# Altium schematic sheet Reefing-Radio.SchDoc: Reefing System
size A4; DocumentNumber: Subtitle; Revision: V1.0; SheetNumber: 8; SheetTotal: 13; Author: Luca Jost; Subtitle: Radio
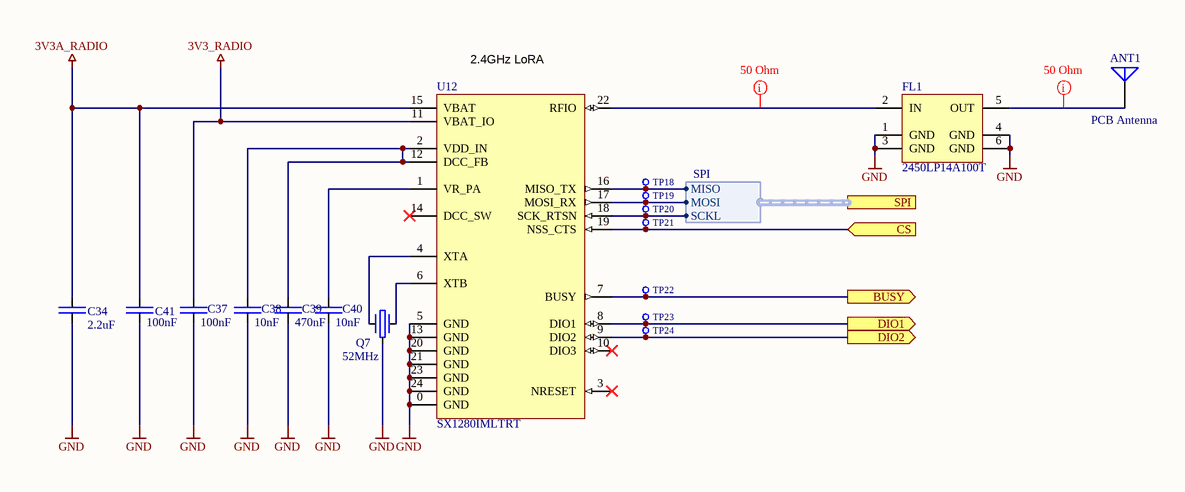
[diagram p0: Reefing-Radio.SchDoc]

## Parts
ANT1  PCB Antenna  [SMD Antenna 2.4GHz TI-AN043]
C34  2.2uF  [SMD Keramikkondensator 0402]
C37  100nF  [SMD Keramikkondensator 0402]
C38  10nF  [SMD Keramikkondensator 0402]
C39  470nF  [SMD Keramikkondensator 0402]
C40  10nF  [SMD Keramikkondensator 0402]
C41  100nF  [SMD Keramikkondensator 0402]
FL1  2450LP14A100T  [SMD Filter 2450LP14A100T]
Q7  52MHz  [SMD Crystal 2520]
TP18  X-TP  [SMD Testpoint 1mm]  (value not drawn)  (no BOM)
TP19  X-TP  [SMD Testpoint 1mm]  (value not drawn)  (no BOM)
TP20  X-TP  [SMD Testpoint 1mm]  (value not drawn)  (no BOM)
TP21  X-TP  [SMD Testpoint 1mm]  (value not drawn)  (no BOM)
TP22  X-TP  [SMD Testpoint 1mm]  (value not drawn)  (no BOM)
TP23  X-TP  [SMD Testpoint 1mm]  (value not drawn)  (no BOM)
TP24  X-TP  [SMD Testpoint 1mm]  (value not drawn)  (no BOM)
U12  SX1280IMLTRT  [SMD IC QFN-24]

## Ports
BUSY (out), CS (in), DIO1 (out), DIO2 (out), SPI (harness SPI)

## Harnesses
SPI: SCKL, MOSI, MISO

## Nets
3V3_RADIO: C37.2 U12.11(VBAT_IO)
3V3A_RADIO: C34.2 C41.2 U12.15(VBAT)
GND: C34.1 C37.1 C38.1 C39.1 C40.1 C41.1 FL1.1(GND) FL1.3(GND) FL1.4(GND) FL1.6(GND) Q7.3 U12.0(GND) U12.5(GND) U12.13(GND) U12.20(GND) U12.21(GND) U12.23(GND) U12.24(GND)
BUSY: TP22.1 U12.7(BUSY) ; port BUSY
CS: TP21.1 U12.19(NSS_CTS) ; port CS
DIO1: TP23.1 U12.8(DIO1) ; port DIO1
DIO2: TP24.1 U12.9(DIO2) ; port DIO2
NetANT1_1: ANT1.1 FL1.5(OUT)
NetC38_2: C38.2 C39.2 U12.2(VDD_IN) U12.12(DCC_FB)
NetC40_2: C40.2 U12.1(VR_PA)
NetFL1_2: FL1.2(IN) U12.22(RFIO)
NetQ7_1: Q7.1 U12.4(XTA)
NetQ7_2: Q7.2 U12.6(XTB)
NetTP18_1: TP18.1 U12.16(MISO_TX) ; port SPI.MISO
NetTP19_1: TP19.1 U12.17(MOSI_RX) ; port SPI.MOSI
NetTP20_1: TP20.1 U12.18(SCK_RTSN) ; port SPI.SCKL

Not connected (* = marked no-connect by the designer): U12 3(NRESET)* 10(DIO3)* 14(DCC_SW)*

## Layout directives
rule Impedance Constraint [Min = 50.00    Max = 50.00    ]; net class RF-Line 50: NetANT1_1, NetFL1_2

## Notes on the sheet
- (near U12) 2.4GHz LoRA
- Title
- Author:
- Subtitle
- Date:
- Rev:
- File:
- Sheet
- of

## Library data of the parts
ANT1 = ANT-PCB 2.4GHz TI-AN043: Small Size 2.4 GHz PCB antenna; ComponentLink1Description: Datasheet; ComponentLink1URL: https://www.ti.com/lit/an/swra117d/swra117d.pdf?ts=1645439751186&ref_url=https%253A%252F%252Fwww.google.com%252F; Unit Price: 0.00
C34 = E6 - 2.2uF: SMD Ceramic Capacitor E6; Unit Price: 0.01; JLC: C193620
C37 C41 = E6 - 100nF: SMD Ceramic Capacitor E6; Unit Price: 0.01; JLC: C307331
C38 C40 = E6 - 10nF: SMD Ceramic Capacitor E6; Unit Price: 0.01; JLC: C15195
C39 = E6 - 470nF: SMD Ceramic Capacitor E6; Unit Price: 0.01; JLC: C47339
FL1 = 2450LP14A100T: 2.45GHz Center Frequency Low Pass RF Filter (Radio Frequency) 100MHz Bandwidth 0.5dB 0603 (1608 Metric), 6 PC Pad; ComponentLink1Description: Datasheet; ComponentLink1URL: https://www.johansontechnology.com/datasheets/2450LP14A100/2450LP14A100.pdf; Digikey: 712-1129-2-ND
Q7 = Crystal 52MHz - 2520: 52Mhz Ceramic 2.5 x 2.0mm SMD 10pF 60Ω ±10ppm; JLC: C963550; ComponentLink1Description: Datasheet; ComponentLink1URL: https://datasheet.lcsc.com/lcsc/2012211835_WTL-WTL2M75523TW_C963550.pdf; Unit Price: 0.39
TP18-TP24 = X-TP: Testpunkt; Unit Price: 0.00
U12 = SX1280IMLTRT: Long Range, Low Power, 2.4 GHz / Transceiver with Ranging Capability; ComponentLink1Description: Datasheet; ComponentLink1URL: https://media.digikey.com/pdf/Data%20Sheets/Semtech%20PDFs/SX1280-81_Rev3.2_Mar2020.pdf; Digikey: SX1280IMLTRTCT-ND; JLC: C125969; Unit Price: 3.20